# Altium schematic sheet MPU.SchDoc
size A2 portrait
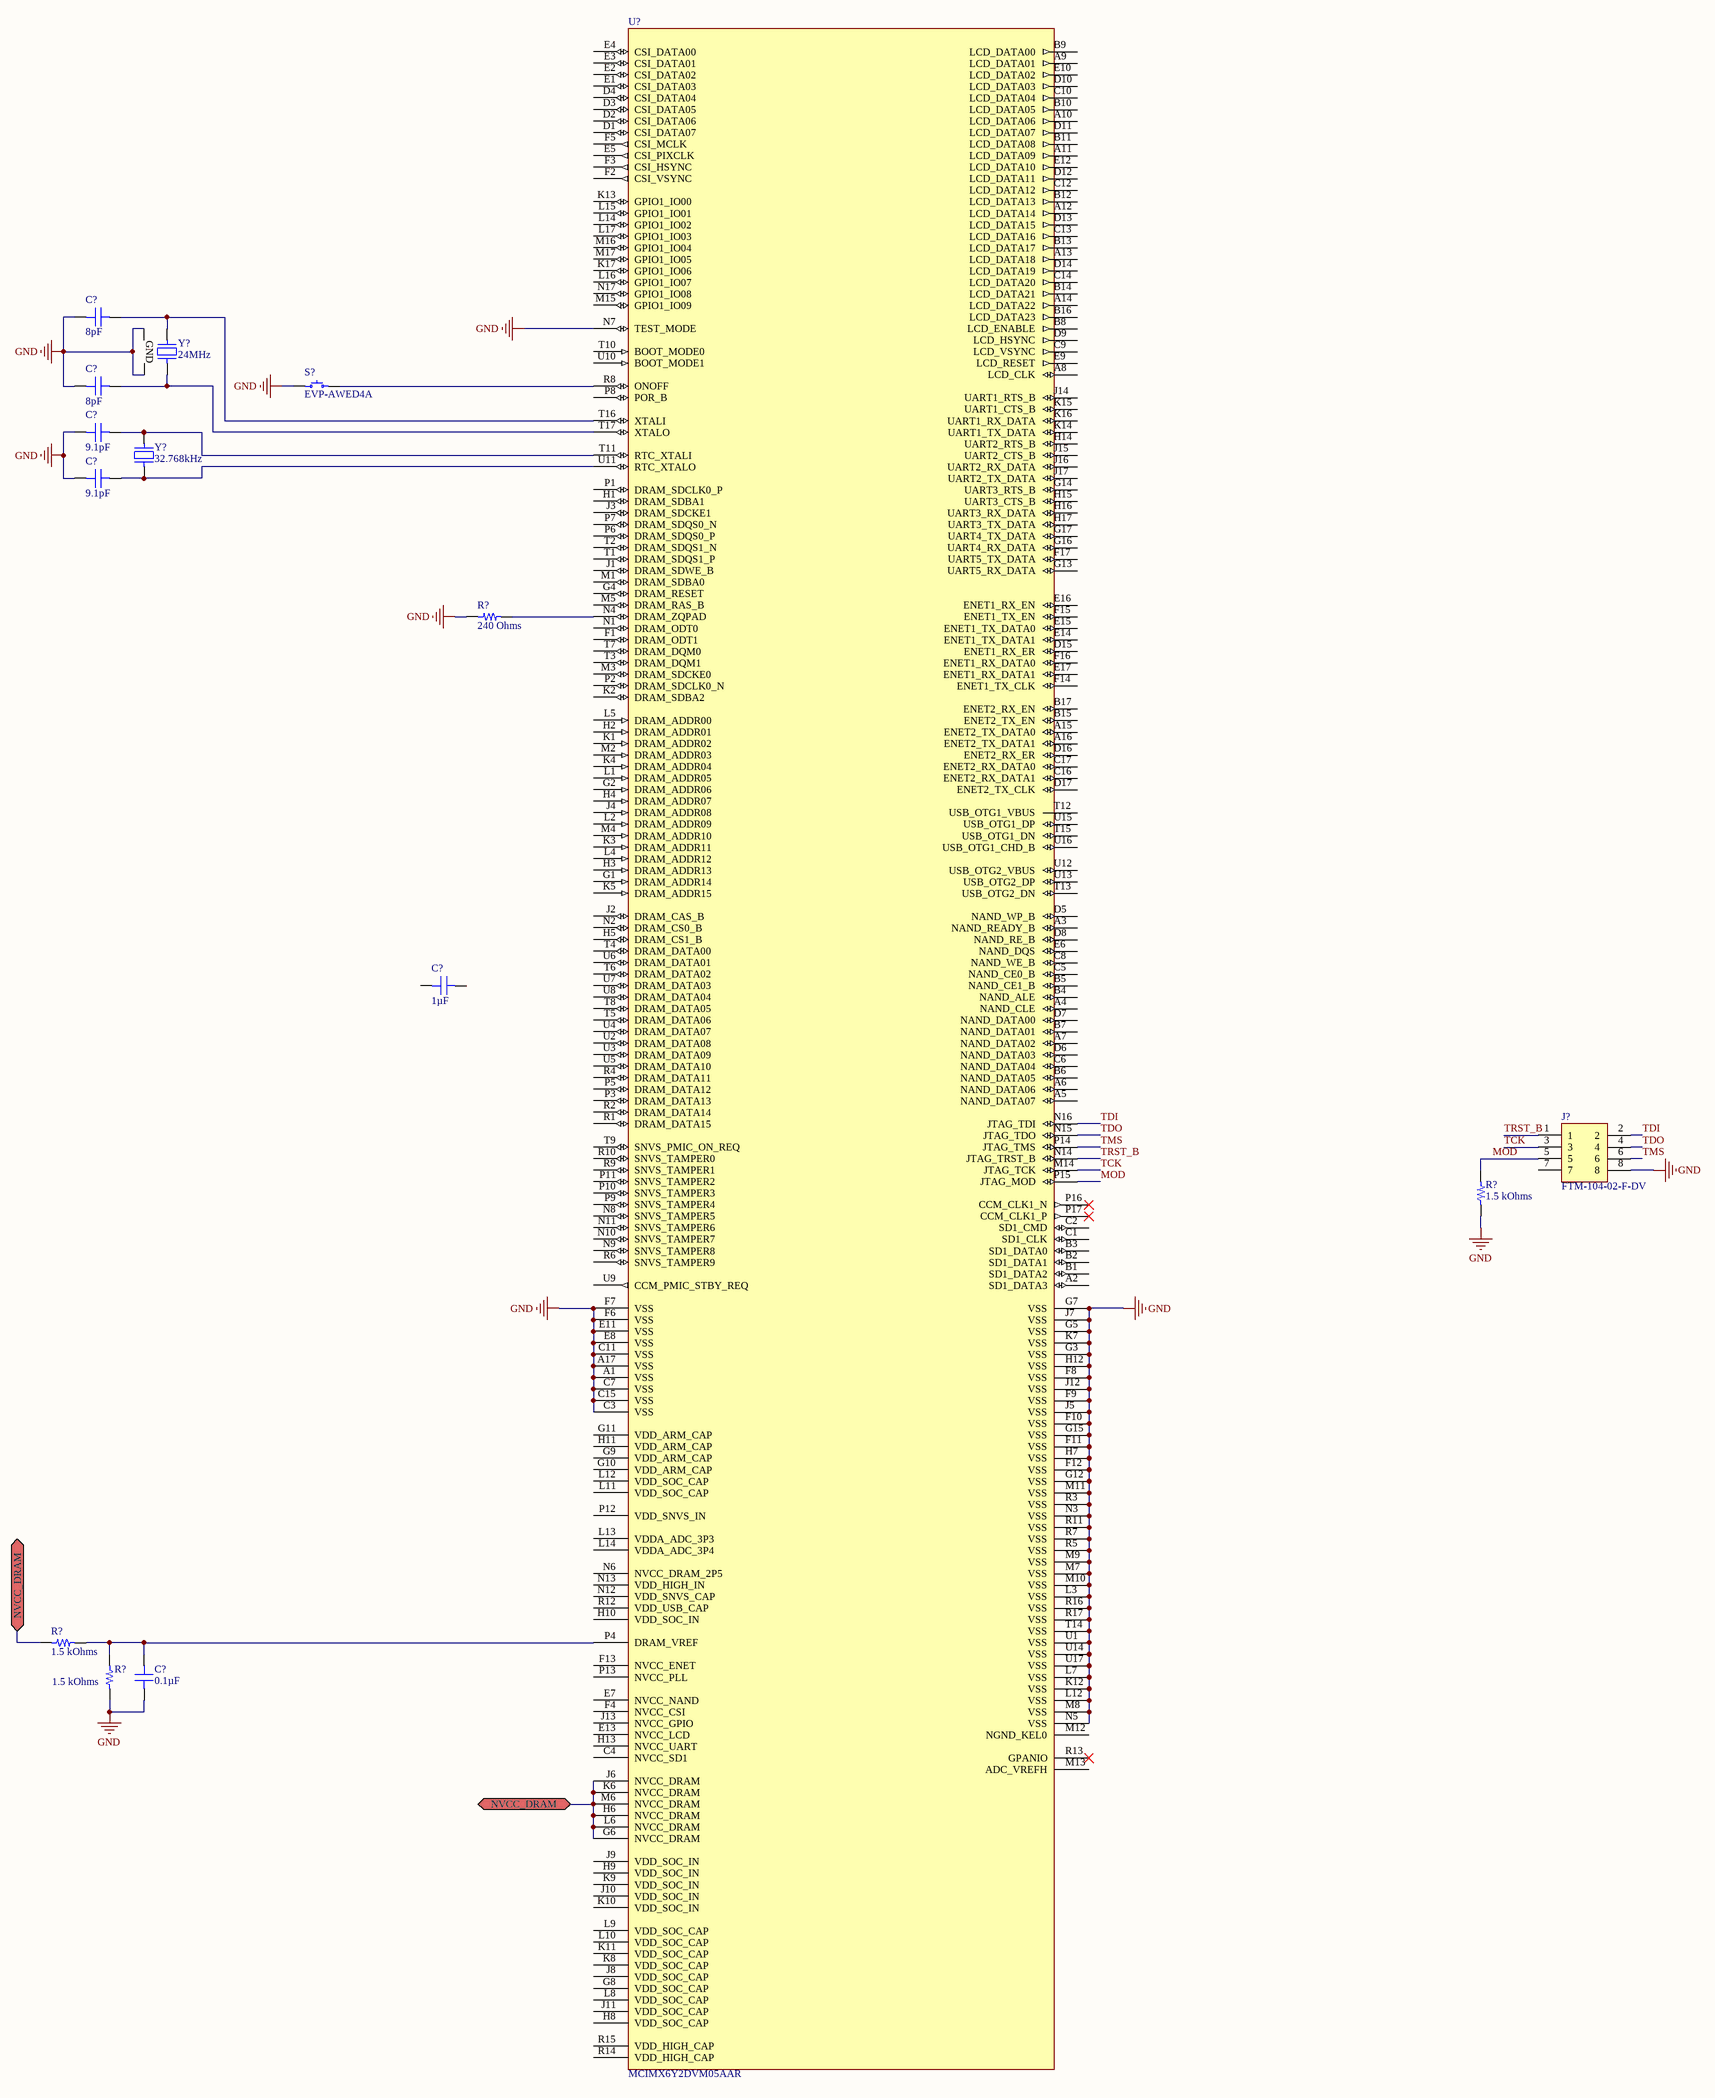
[diagram p0: MPU.SchDoc]

## Parts
(Parts that share a designator on the sheet are numbered #1, #2 ... from top to bottom, then left to right.)
C?#1  8pF  [CAP 0402_1005]
C?#2  8pF  [CAP 0402_1005]
C?#3  9.1pF  [CAP 0402_1005]
C?#4  9.1pF  [CAP 0402_1005]
C?#5  1µF  [CAP 0402_1005]
C?#6  0.1µF  [CAP 0402_1005]
J?  FTM-104-02-F-DV  [FTM-104-XX-Y-DV]
R?#1  240 Ohms  [RES 0402_1005]
R?#2  1.5 kOhms  [RES 0402_1005]
R?#3  1.5 kOhms  [RES 0402_1005]
R?#4  1.5 kOhms  [RES 0402_1005]
S?  EVP-AWED4A  [PANASONIC EVPAW]
U?  MCIMX6Y2DVM05AAR  [BGA289C80P17X17_1400X1400X132]
Y?#1  24MHz  [ABRACON ABM10]
Y?#2  32.768kHz  [ABRACON ABS06]

## Ports
NVCC_DRAM (bidir)

## Nets
GND: C?#1.1 C?#2.1 C?#3.1 C?#4.1 C?#6.1 J?.8 R?#1.1 R?#2.1 R?#4.1 S?.1 U?.A1(VSS) U?.A17(VSS) U?.C3(VSS) U?.C7(VSS) U?.C11(VSS) U?.C15(VSS) U?.E8(VSS) U?.E11(VSS) U?.F6(VSS) U?.F7(VSS) U?.F8(VSS) U?.F9(VSS) U?.F10(VSS) U?.F11(VSS) U?.F12(VSS) U?.G3(VSS) U?.G5(VSS) U?.G7(VSS) U?.G12(VSS) U?.G15(VSS) U?.H7(VSS) U?.H12(VSS) U?.J5(VSS) U?.J7(VSS) U?.J12(VSS) U?.K7(VSS) U?.K12(VSS) U?.L3(VSS) U?.L7(VSS) U?.L12(VSS) U?.M7(VSS) U?.M8(VSS) U?.M9(VSS) U?.M10(VSS) U?.M11(VSS) U?.N3(VSS) U?.N5(VSS) U?.N7(TEST_MODE) U?.R3(VSS) U?.R5(VSS) U?.R7(VSS) U?.R11(VSS) U?.R16(VSS) U?.R17(VSS) U?.T14(VSS) U?.U1(VSS) U?.U14(VSS) U?.U17(VSS) Y?#1.2(GND) Y?#1.4(GND)
MOD: J?.5 R?#2.2 U?.P15(JTAG_MOD)
NVCC_DRAM: R?#3.1 U?.G6(NVCC_DRAM) U?.H6(NVCC_DRAM) U?.J6(NVCC_DRAM) U?.K6(NVCC_DRAM) U?.L6(NVCC_DRAM) U?.M6(NVCC_DRAM) ; port NVCC_DRAM
TCK: J?.3 U?.M14(JTAG_TCK)
TDI: J?.2 U?.N16(JTAG_TDI)
TDO: J?.4 U?.N15(JTAG_TDO)
TMS: J?.6 U?.P14(JTAG_TMS)
TRST_B: J?.1 U?.N14(JTAG_TRST_B)
NetC?#1_2: C?#1.2 U?.T16(XTALI) Y?#1.1
NetC?#2_2: C?#2.2 U?.T17(XTALO) Y?#1.3
NetC?#3_2: C?#3.2 U?.T11(RTC_XTALI) Y?#2.1
NetC?#4_2: C?#4.2 U?.U11(RTC_XTALO) Y?#2.2
NetC?#6_2: C?#6.2 R?#3.2 R?#4.2 U?.P4(DRAM_VREF)
NetR?#1_2: R?#1.2 U?.N4(DRAM_ZQPAD)
NetS?_2: S?.2 U?.R8(ONOFF)

Not connected (* = marked no-connect by the designer): C?#5 1 2; J? 7; U? A2(SD1_DATA3) A3(NAND_READY_B) A4(NAND_CLE) A5(NAND_DATA07) A6(NAND_DATA06) A7(NAND_DATA02) A8(LCD_CLK) A9(LCD_DATA01) A10(LCD_DATA06) A11(LCD_DATA09) A12(LCD_DATA14) A13(LCD_DATA18) A14(LCD_DATA22) A15(ENET2_TX_DATA0) A16(ENET2_TX_DATA1) B1(SD1_DATA2) B2(SD1_DATA1) B3(SD1_DATA0) B4(NAND_ALE) B5(NAND_CE1_B) B6(NAND_DATA05) B7(NAND_DATA01) B8(LCD_ENABLE) B9(LCD_DATA00) B10(LCD_DATA05) B11(LCD_DATA08) B12(LCD_DATA13) B13(LCD_DATA17) B14(LCD_DATA21) B15(ENET2_TX_EN) B16(LCD_DATA23) B17(ENET2_RX_EN) C1(SD1_CLK) C2(SD1_CMD) C4(NVCC_SD1) C5(NAND_CE0_B) C6(NAND_DATA04) C8(NAND_WE_B) C9(LCD_VSYNC) C10(LCD_DATA04) C12(LCD_DATA12) C13(LCD_DATA16) C14(LCD_DATA20) C16(ENET2_RX_DATA1) C17(ENET2_RX_DATA0) D1(CSI_DATA07) D2(CSI_DATA06) D3(CSI_DATA05) D4(CSI_DATA04) D5(NAND_WP_B) D6(NAND_DATA03) D7(NAND_DATA00) D8(NAND_RE_B) D9(LCD_HSYNC) D10(LCD_DATA03) D11(LCD_DATA07) D12(LCD_DATA11) D13(LCD_DATA15) D14(LCD_DATA19) D15(ENET1_RX_ER) D16(ENET2_RX_ER) D17(ENET2_TX_CLK) E1(CSI_DATA03) E2(CSI_DATA02) E3(CSI_DATA01) E4(CSI_DATA00) E5(CSI_PIXCLK) E6(NAND_DQS) E7(NVCC_NAND) E9(LCD_RESET) E10(LCD_DATA02) E12(LCD_DATA10) E13(NVCC_LCD) E14(ENET1_TX_DATA1) E15(ENET1_TX_DATA0) E16(ENET1_RX_EN) E17(ENET1_RX_DATA1) F1(DRAM_ODT1) F2(CSI_VSYNC) F3(CSI_HSYNC) F4(NVCC_CSI) F5(CSI_MCLK) F13(NVCC_ENET) F14(ENET1_TX_CLK) F15(ENET1_TX_EN) F16(ENET1_RX_DATA0) F17(UART5_TX_DATA) G1(DRAM_ADDR14) G2(DRAM_ADDR06) G4(DRAM_RESET) G8(VDD_SOC_CAP) G9(VDD_ARM_CAP) G10(VDD_ARM_CAP) G11(VDD_ARM_CAP) G13(UART5_RX_DATA) G14(UART3_RTS_B) G16(UART4_RX_DATA) G17(UART4_TX_DATA) H1(DRAM_SDBA1) H2(DRAM_ADDR01) H3(DRAM_ADDR13) H4(DRAM_ADDR07) H5(DRAM_CS1_B) H8(VDD_SOC_CAP) H9(VDD_SOC_IN) H10(VDD_SOC_IN) H11(VDD_ARM_CAP) H13(NVCC_UART) H14(UART2_RTS_B) H15(UART3_CTS_B) H16(UART3_RX_DATA) H17(UART3_TX_DATA) J1(DRAM_SDWE_B) J2(DRAM_CAS_B) J3(DRAM_SDCKE1) J4(DRAM_ADDR08) J8(VDD_SOC_CAP) J9(VDD_SOC_IN) J10(VDD_SOC_IN) J11(VDD_SOC_CAP) J13(NVCC_GPIO) J14(UART1_RTS_B) J15(UART2_CTS_B) J16(UART2_RX_DATA) J17(UART2_TX_DATA) K1(DRAM_ADDR02) K2(DRAM_SDBA2) K3(DRAM_ADDR11) K4(DRAM_ADDR04) K5(DRAM_ADDR15) K8(VDD_SOC_CAP) K9(VDD_SOC_IN) K10(VDD_SOC_IN) K11(VDD_SOC_CAP) K13(GPIO1_IO00) K14(UART1_TX_DATA) K15(UART1_CTS_B) K16(UART1_RX_DATA) K17(GPIO1_IO06) L1(DRAM_ADDR05) L2(DRAM_ADDR09) L4(DRAM_ADDR12) L5(DRAM_ADDR00) L8(VDD_SOC_CAP) L9(VDD_SOC_CAP) L10(VDD_SOC_CAP) L11(VDD_SOC_CAP) L13(VDDA_ADC_3P3) L14(GPIO1_IO02) L15(GPIO1_IO01) L16(GPIO1_IO07) L17(GPIO1_IO03) M1(DRAM_SDBA0) M2(DRAM_ADDR03) M3(DRAM_SDCKE0) M4(DRAM_ADDR10) M5(DRAM_RAS_B) M12(NGND_KEL0) M13(ADC_VREFH) M15(GPIO1_IO09) M16(GPIO1_IO04) M17(GPIO1_IO05) N1(DRAM_ODT0) N2(DRAM_CS0_B) N6(NVCC_DRAM_2P5) N8(SNVS_TAMPER5) N9(SNVS_TAMPER8) N10(SNVS_TAMPER7) N11(SNVS_TAMPER6) N12(VDD_SNVS_CAP) N13(VDD_HIGH_IN) N17(GPIO1_IO08) P1(DRAM_SDCLK0_P) P2(DRAM_SDCLK0_N) P3(DRAM_DATA13) P5(DRAM_DATA12) P6(DRAM_SDQS0_P) P7(DRAM_SDQS0_N) P8(POR_B) P9(SNVS_TAMPER4) P10(SNVS_TAMPER3) P11(SNVS_TAMPER2) P12(VDD_SNVS_IN) P13(NVCC_PLL) P16(CCM_CLK1_N)* P17(CCM_CLK1_P)* R1(DRAM_DATA15) R2(DRAM_DATA14) R4(DRAM_DATA11) R6(SNVS_TAMPER9) R9(SNVS_TAMPER1) R10(SNVS_TAMPER0) R12(VDD_USB_CAP) R13(GPANIO)* R14(VDD_HIGH_CAP) R15(VDD_HIGH_CAP) T1(DRAM_SDQS1_P) T2(DRAM_SDQS1_N) T3(DRAM_DQM1) T4(DRAM_DATA00) T5(DRAM_DATA06) T6(DRAM_DATA02) T7(DRAM_DQM0) T8(DRAM_DATA05) T9(SNVS_PMIC_ON_REQ) T10(BOOT_MODE0) T12(USB_OTG1_VBUS) T13(USB_OTG2_DN) T15(USB_OTG1_DN) U2(DRAM_DATA08) U3(DRAM_DATA09) U4(DRAM_DATA07) U5(DRAM_DATA10) U6(DRAM_DATA01) U7(DRAM_DATA03) U8(DRAM_DATA04) U9(CCM_PMIC_STBY_REQ) U10(BOOT_MODE1) U12(USB_OTG2_VBUS) U13(USB_OTG2_DP) U15(USB_OTG1_DP) U16(USB_OTG1_CHD_B)

## Notes on the sheet
- Title
- Size:
- Date:
- File:
- A2
- Number:
- Time:
- Revision:
- Sheet
- of

## Library data of the parts
C?#1 C?#2 = CC0402BRNPO9BN8R0: CAP CER 8PF 50V NPO 0402; Manufacturer: Yageo; Temperature Coefficient: C0G, NP0; Tolerance: ±0.1pF; Part Number: CC0402BRNPO9BN8R0; Value: 8pF; Applications: General Purpose; Capacitance: 8pF; ComponentLink1Description: Datasheet; ComponentLink1URL: https://www.yageo.com/upload/media/product/productsearch/datasheet/mlcc/UPY-GP_NP0_16V-to-50V_17.pdf; ComponentLink2Description: DigiKey Link; ComponentLink2URL: http://digikey.com/product-detail/en/yageo/CC0402BRNPO9BN8R0/311-3708-1-ND/8024797; Device Package: 0402 (1005 Metric); LastUpdated: 2/9/2020 1:02:16; Lifecycle Status: Active; Minimum Order: 1; Mounting Type: Surface Mount, MLCC; Operating Temperature: -55°C ~ 125°C; Package / Case: 0402 (1005 Metric); Packaging: TapeAndReel; PartId: 5655; Part Status: Active; Price: 0.01; Series: CC; Size / Dimension: 0.039" L x 0.020" W (1.00mm x 0.50mm); Supplier 1: DigiKey; Supplier Part Number 1: 311-3708-1-ND; Thickness (Max): 0.022" (0.55mm); Voltage - Rated: 50V
C?#3 C?#4 = 500R07S9R1CV4T: CAP CER 9.1PF 50V C0G/NP0 0402; Manufacturer: Johanson Technology Inc.; Temperature Coefficient: C0G, NP0; Tolerance: ±0.25pF; Part Number: 500R07S9R1CV4T; Value: 9.1pF; Applications: RF, Microwave, High Frequency; Capacitance: 9.1pF; ComponentLink1Description: Datasheet; ComponentLink1URL: https://www.johansontechnology.com/downloads/catalog/johanson-technology-multi-layer-high-q-capacitors.pdf; ComponentLink2Description: DigiKey Link; ComponentLink2URL: http://digikey.com/product-detail/en/johanson-technology-inc/500R07S9R1CV4T/712-1294-1-ND/1786756; Device Package: 0402 (1005 Metric); Features: High Q, Low Loss, Ultra Low ESR; LastUpdated: 2/9/2020 1:02:17; Lifecycle Status: Active; Minimum Order: 1; Mounting Type: Surface Mount, MLCC; Operating Temperature: -55°C ~ 125°C; Package / Case: 0402 (1005 Metric); Packaging: TapeAndReel; PartId: 5073; Part Status: Active; Price: 0.04; Series: S; Size / Dimension: 0.040" L x 0.020" W (1.02mm x 0.51mm); Supplier 1: DigiKey; Supplier Part Number 1: 712-1294-1-ND; Thickness (Max): 0.024" (0.61mm); Voltage - Rated: 50V
C?#5 = GCM155C71A105ME38D: CAP CERAMIC 1UF 10V X7S 20% PAD; Manufacturer: Murata Electronics; Part Number: GCM155C71A105ME38D; Value: 1µF; Applications: Automotive; Capacitance: 1µF; ComponentLink1Description: Datasheet; ComponentLink1URL: https://search.murata.co.jp/Ceramy/image/img/A01X/G101/ENG/GCM155C71A105ME38-01.pdf; ComponentLink2Description: DigiKey Link; ComponentLink2URL: http://digikey.com/product-detail/en/murata-electronics/GCM155C71A105ME38D/490-18202-1-ND/9867931; Device Package: 0402 (1005 Metric); LastUpdated: 2/9/2020 1:02:18; Lifecycle Status: Active; Minimum Order: 1; Mounting Type: Surface Mount, MLCC; Operating Temperature: -55°C ~ 125°C; Package / Case: 0402 (1005 Metric); Packaging: TapeAndReel; PartId: 4642; Part Status: Active; Price: 0.02; Ratings: AEC-Q200; Series: GCM; Size / Dimension: 0.039" L x 0.020" W (1.00mm x 0.50mm); Supplier 1: DigiKey; Supplier Part Number 1: 490-18202-1-ND; Temperature Coefficient: X7S; Thickness (Max): 0.028" (0.70mm); Tolerance: ±20%; Voltage - Rated: 10V
C?#6 = 0402ZD104KAT2A: CAP CER 0.1UF 10V X5R 0402; Manufacturer: AVX Corporation; Tolerance: ±10%; Part Number: 0402ZD104KAT2A; Value: 0.1µF; Applications: General Purpose; Capacitance: 0.1µF; ComponentLink1Description: Datasheet; ComponentLink1URL: http://datasheets.avx.com/cx5r.pdf; ComponentLink2Description: DigiKey Link; ComponentLink2URL: http://digikey.com/product-detail/en/avx-corporation/0402ZD104KAT2A/478-1129-1-ND/564161; Device Package: 0402 (1005 Metric); LastUpdated: 2/9/2020 1:01:39; Lifecycle Status: Active; Minimum Order: 1; Mounting Type: Surface Mount, MLCC; Operating Temperature: -55°C ~ 85°C; Package / Case: 0402 (1005 Metric); Packaging: TapeAndReel; PartId: 12555; Part Status: Active; Price: 0.01; Series: -; Size / Dimension: 0.039" L x 0.020" W (1.00mm x 0.50mm); Supplier 1: DigiKey; Supplier Part Number 1: 478-1129-1-ND; Temperature Coefficient: X5R; Thickness (Max): 0.022" (0.56mm); Voltage - Rated: 10V
J? = FTM-104-02-F-DV: Connector; Manufacturer_Name: SAMTEC; Datasheet Link: http://suddendocs.samtec.com/prints/ftm-1xx-xx-xx-dv-xx-mkt.pdf; Manufacturer_Part_Number: FTM-104-02-F-DV
R?#1 = TNPW0402240RBEED: RES 240 OHM 0.1% 1/16W 0402; Manufacturer: Vishay Dale; Power (Watts): 0.1W, 1/10W; Temperature Coefficient: ±25ppm/°C; Part Number: TNPW0402240RBEED; Value: 240 Ohms; ComponentLink1Description: Datasheet; ComponentLink1URL: http://www.vishay.com/docs/28758/tnpw_e3.pdf; ComponentLink2Description: DigiKey Link; ComponentLink2URL: http://digikey.com/product-detail/en/vishay-dale/TNPW0402240RBEED/541-3141-1-ND/6532783; Composition: Thin Film; Device Package: 0402 (1005 Metric); Features: Anti-Sulfur, Automotive AEC-Q200, Moisture Resistant; Height - Seated (Max): 0.016" (0.40mm); LastUpdated: 2/9/2020 1:07:42; Lifecycle Status: Active; Minimum Order: 1; Number of Terminations: 2; Operating Temperature: -55°C ~ 155°C; Package / Case: 0402 (1005 Metric); Packaging: TapeAndReel; PartId: 15372; Part Status: Active; Price: 0.11; Ratings: AEC-Q200; Resistance: 240 Ohms; Series: TNPW e3; Size / Dimension: 0.039" L x 0.020" W (1.00mm x 0.50mm); Supplier 1: DigiKey; Supplier Part Number 1: 541-3141-1-ND; Supplier Device Package: 0402; Tolerance: ±0.1%
R?#2-R?#4 = RP73PF1E1K5BTD: RES 1.5K OHM 0.1% 1/10W 0402; Manufacturer: TE Connectivity Passive Product; Power (Watts): 0.1W, 1/10W; Temperature Coefficient: ±25ppm/°C; Part Number: RP73PF1E1K5BTD; Value: 1.5 kOhms; ComponentLink1Description: Datasheet; ComponentLink1URL: https://www.te.com/commerce/DocumentDelivery/DDEController?Action=srchrtrv&DocNm=1773272&DocType=DS&DocLang=English; ComponentLink2Description: DigiKey Link; ComponentLink2URL: http://digikey.com/product-detail/en/te-connectivity-passive-product/RP73PF1E1K5BTD/A127336CT-ND/8261302; Composition: Thin Film; Device Package: 0402 (1005 Metric); Height - Seated (Max): 0.014" (0.35mm); LastUpdated: 2/9/2020 1:07:25; Lifecycle Status: Active; Minimum Order: 1; Number of Terminations: 2; Operating Temperature: -55°C ~ 155°C; Package / Case: 0402 (1005 Metric); Packaging: TapeAndReel; PartId: 21692; Part Status: Active; Price: 0.08; Resistance: 1.5 kOhms; Series: RP73P, Holsworthy; Size / Dimension: 0.039" L x 0.020" W (1.00mm x 0.50mm); Supplier 1: DigiKey; Supplier Part Number 1: A127336CT-ND; Supplier Device Package: 0402; Tolerance: ±0.1%
S? = EVP-AWED4A: 3.0MM X 2.0MM / 3.3N / 0.15MM ST; Manufacturer: Panasonic Electronic Components; Actuator Height off PCB, Vertical: 0.60mm; Actuator Orientation: Top Actuated; Actuator Type: Standard; Circuit: SPST-NO; Contact Rating @ Voltage: 0.02A @ 15VDC; Illumination: Non-Illuminated; Ingress Protection: IP67 - Dust Tight, Waterproof; Operating Force: 330gf; Outline: 3.00mm x 2.00mm; Switch Function: Off-Mom; Part Number: EVP-AWED4A; ComponentLink1Description: Datasheet; ComponentLink1URL: https://industrial.panasonic.com/ac/cdn/e/control/switch/light-touch/catalog/sw_lt_eng_3020s.pdf; ComponentLink2Description: DigiKey Link; ComponentLink2URL: http://digikey.com/product-detail/en/panasonic-electronic-components/EVP-AWED4A/P123440CT-ND/8568287; LastUpdated: 2/9/2020 1:27:07; Lifecycle Status: Active; Minimum Order: 1; Mounting Type: Surface Mount; Operating Temperature: -40°C ~ 85°C; Packaging: TapeAndReel; Part Status: Active; Price: 0.14; Series: EVPAW; Supplier 1: DigiKey; Supplier Part Number 1: P123440CT-ND; Termination Style: SMD (SMT) Tab
U? = MCIMX6Y2DVM05AAR: MCIMX6YxD
Y?#1 = ABM10-24.000MHZ-8-7-A15-T: CRYSTAL 24.0000MHZ 8PF SMD; Manufacturer: Abracon LLC; ESR (Equivalent Series Resistance): 100 Ohms; Frequency Stability: ±15ppm; Operating Mode: Fundamental; Part Number: ABM10-24.000MHZ-8-7-A15-T; ComponentLink1Description: Datasheet; ComponentLink1URL: https://abracon.com/Resonators/ABM10.pdf; ComponentLink2Description: DigiKey Link; ComponentLink2URL: http://digikey.com/product-detail/en/abracon-llc/ABM10-24.000MHZ-8-7-A15-T/535-9622-1-ND/1237089; Device Package: 4-SMD, No Lead; Frequency: 24MHz; Frequency Tolerance: ±15ppm; Height - Seated (Max): 0.028" (0.70mm); LastUpdated: 19/3/2020 22:27:46; Lifecycle Status: Active; Load Capacitance: 8pF; Minimum Order: 1; Mounting Type: Surface Mount; Operating Temperature: -10°C ~ 60°C; Package / Case: 4-SMD, No Lead; Packaging: TapeAndReel; PartId: 265; Part Status: Active; Price: 0.60; Series: ABM10; Size / Dimension: 0.098" L x 0.079" W (2.50mm x 2.00mm); Supplier 1: DigiKey; Supplier Part Number 1: 535-9622-1-ND; Type: MHz Crystal; Value: 24MHz
Y?#2 = ABS06-32.768KHZ-9-1-T: CRYSTAL 32.7680KHZ 9PF SMD; Manufacturer: Abracon LLC; ESR (Equivalent Series Resistance): 90 kOhms; Frequency Tolerance: ±10ppm; Operating Mode: Fundamental; Part Number: ABS06-32.768KHZ-9-1-T; ComponentLink1Description: Datasheet; ComponentLink1URL: https://abracon.com/Resonators/ABS06.pdf; ComponentLink2Description: DigiKey Link; ComponentLink2URL: http://digikey.com/product-detail/en/abracon-llc/ABS06-32.768KHZ-9-1-T/535-10247-1-ND/2218060; Frequency: 32.768kHz; Height - Seated (Max): 0.024" (0.60mm); LastUpdated: 2/9/2020 1:21:47; Lifecycle Status: Active; Load Capacitance: 9pF; Minimum Order: 1; Mounting Type: Surface Mount; Operating Temperature: -40°C ~ 85°C; Package / Case: 2-SMD, No Lead; Packaging: TapeAndReel; PartId: 371; Part Status: Active; Price: 1.05; Series: ABS06; Size / Dimension: 0.079" L x 0.047" W (2.00mm x 1.20mm); Supplier 1: DigiKey; Supplier Part Number 1: 535-10247-1-ND; Type: kHz Crystal (Tuning Fork); Value: 32.768kHz